# Altium schematic sheet Morpheus.SchDoc: Sanhaço - Morpheus
size A4; DocumentNumber: CB05; Revision: 1.1; SheetNumber: 5; SheetTotal: 5
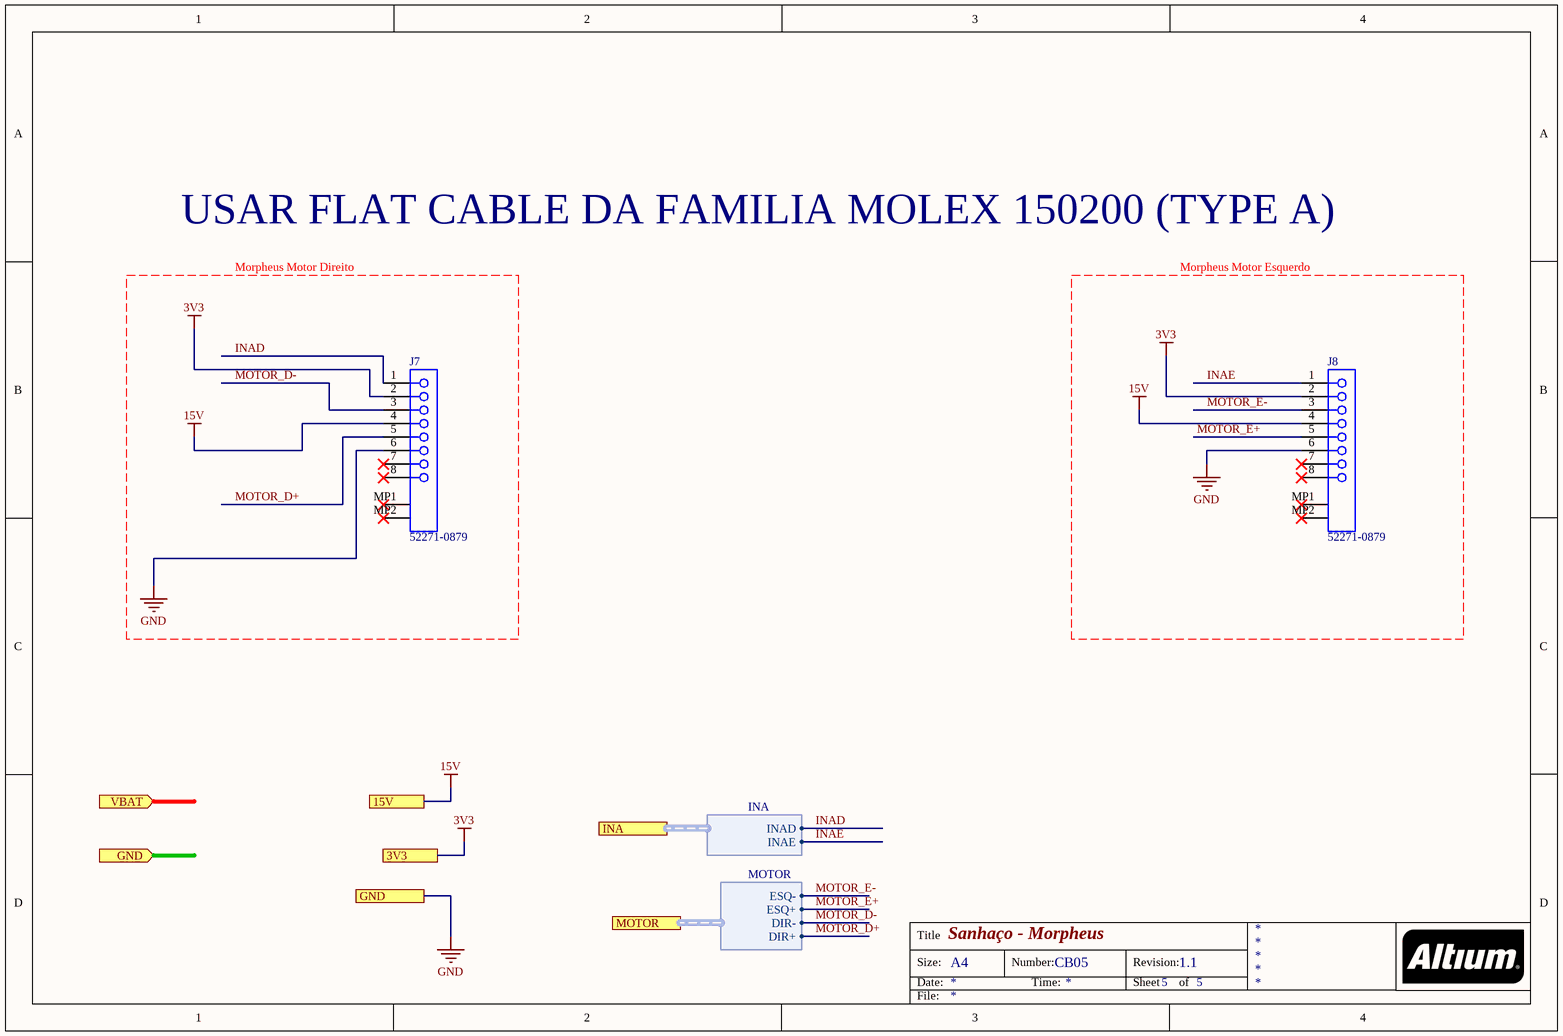
[diagram p0: Morpheus.SchDoc]

## Parts
J7  52271-0879  [MOLX-52271-0879]
J8  52271-0879  [MOLX-52271-0879]

## Ports
3V3, 15V, GND, GND (in), INA (harness INA), MOTOR (harness MOTOR), VBAT (in)

## Harnesses
MOTOR: ESQ+, DIR-, DIR+, ESQ-
INA: INAD, INAE

## Nets
3V3: J7.2 J8.2 ; port 3V3
15V: J7.4 J8.4 ; port 15V
GND: J7.6 J8.6 ; port GND
INAD: J7.1 ; port INA.INAD
INAE: J8.1 ; port INA.INAE
MOTOR_D+: J7.5 ; port MOTOR.DIR+
MOTOR_D-: J7.3 ; port MOTOR.DIR-
MOTOR_E+: J8.5 ; port MOTOR.ESQ+
MOTOR_E-: J8.3 ; port MOTOR.ESQ-

Not connected (* = marked no-connect by the designer): J7 7* 8* MP1* MP2*; J8 7* 8* MP1* MP2*

## Notes on the sheet
- USAR FLAT CABLE DA FAMILIA MOLEX 150200 (TYPE A)
- Morpheus Motor Direito
- Morpheus Motor Esquerdo
- Title
- Size:
- Date:
- A4
- Number:
- Time:
- Revision:
- Sheet
- of
- File:

## Library data of the parts
J7 J8 = CMP-1241-00231-1: 1.0 mm Pitch Easy-On(TM) Type FPC Connector, 3.0 mm Mated Height, Right Angle, ZIF, SMT, Bottom Contact, 8 Circuits, -40 to 85 degC, ELV and RoHS Compliant, Tape and Reel; Manufacturer: Molex; Mated Height: 3.00mm; PCB Retention: Yes; Voltage (Max): 50V AC (RMS)/DC; Material - Metal: Phosphor Bronze; PCB Locator: No; Circuits (Loaded): 8; Material - Plating Termination: Tin-Bismuth; Entry Angle: 90degrees Angle; Pitch - Mating Interface: 1.00mm; Current (Max per Contact): 0.5A; Durability (mating cycles max): 30; PackageReference: 52271-0879; PackageDescription: 8-Lead FPC Connector, Pitch 1.0 mm; Mounting Technology: Surface Mount; ComponentLink1URL: http://www.molex.com/molex/index.jsp; Number of Rows: 1; PackageVersion: Rev. B, 04/2004; ComponentLink1Description: Manufacturer URL; Contact Position: Bottom; RoHS: TRUE; ComponentLink3URL: http://www.molex.com/pdm_docs/sd/522710879_sd.pdf; PartNumber: 52271-0879; Orientation: Right Angle; Stackable: No; ComponentLink2URL: http://www.molex.com/webdocs/datasheets/pdf/en-us/0522710879_FFC_FPC_CONNECTORS.pdf; ComponentLink3Description: Package Specification; ComponentLink2Description: Datasheet; Polarized to PCB: Yes; Packing: Tape and Reel; Material - Plating Mating: Tin-Bismuth; Pitch - Termination Interface: 1.00mm